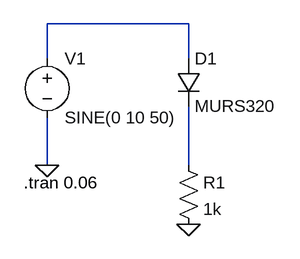
[diagram p0: schematic Draft2.asc]
Draft2.asc, the LTspice schematic file:
Version 4
SHEET 1 880 680
WIRE 336 0 144 0
WIRE 144 48 144 0
WIRE 336 48 336 0
WIRE 144 192 144 128
WIRE 336 192 336 112
FLAG 144 192 0
FLAG 336 272 0
SYMBOL voltage 144 32 R0
WINDOW 123 0 0 Left 0
WINDOW 39 0 0 Left 0
SYMATTR InstName V1
SYMATTR Value SINE(0 10 50)
SYMBOL diode 320 48 R0
SYMATTR InstName D1
SYMATTR Value MURS320
SYMBOL res 320 176 R0
SYMATTR InstName R1
SYMATTR Value 1k
TEXT 112 216 Left 2 !.tran 0.06

The netlist it stands for:
* Draft2.asc
V1 N001 0 SINE(0 10 50)
D1 N001 N002 MURS320
R1 N002 0 1k
.model D D
.lib standard.dio
.tran 0.06
.backanno
.end